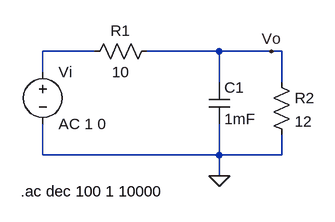
[diagram p0: schematic CET346FinalProject_ACSweep.asc]
CET346FinalProject_ACSweep.asc, the LTspice schematic file:
Version 4
SHEET 1 880 680
WIRE 80 112 0 112
WIRE 272 112 160 112
WIRE 352 112 272 112
WIRE 368 112 352 112
WIRE 0 144 0 112
WIRE 272 160 272 112
WIRE 368 160 368 112
WIRE 0 272 0 224
WIRE 272 272 272 224
WIRE 272 272 0 272
WIRE 368 272 368 240
WIRE 368 272 272 272
WIRE 272 304 272 272
FLAG 272 304 0
FLAG 352 112 Vo
SYMBOL voltage 0 128 R0
SYMATTR InstName Vi
SYMATTR Value AC 1 0
SYMBOL res 176 96 R90
WINDOW 0 0 56 VBottom 2
WINDOW 3 32 56 VTop 2
SYMATTR InstName R1
SYMATTR Value 10
SYMBOL res 352 144 R0
SYMATTR InstName R2
SYMATTR Value 12
SYMBOL cap 256 160 R0
SYMATTR InstName C1
SYMATTR Value 1mF
TEXT -34 328 Left 2 !.ac dec 100 1 10000

The netlist it stands for:
* CET346FinalProject_ACSweep.asc
Vi N001 0 AC 1 0
R1 Vo N001 10
R2 Vo 0 12
C1 Vo 0 1mF
.ac dec 100 1 10000
.backanno
.end